# EAGLE board DAQShield (EAGLE 9.6.0)
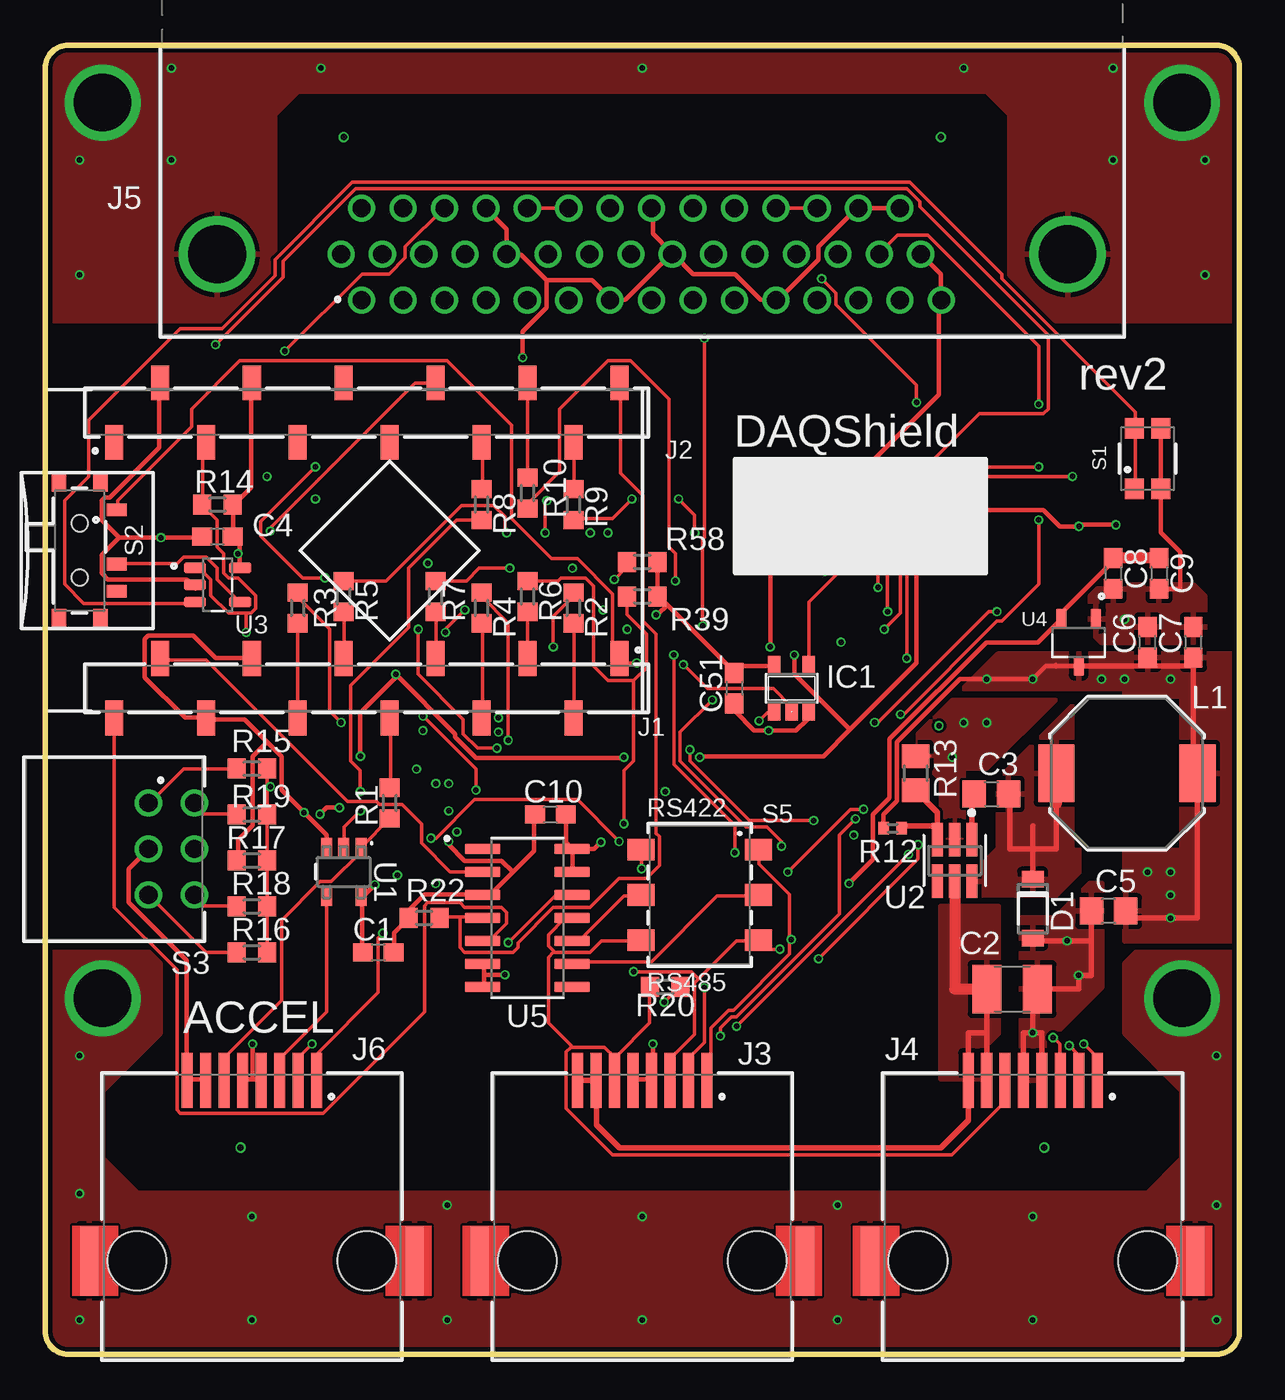
[diagram p6: board, top side]
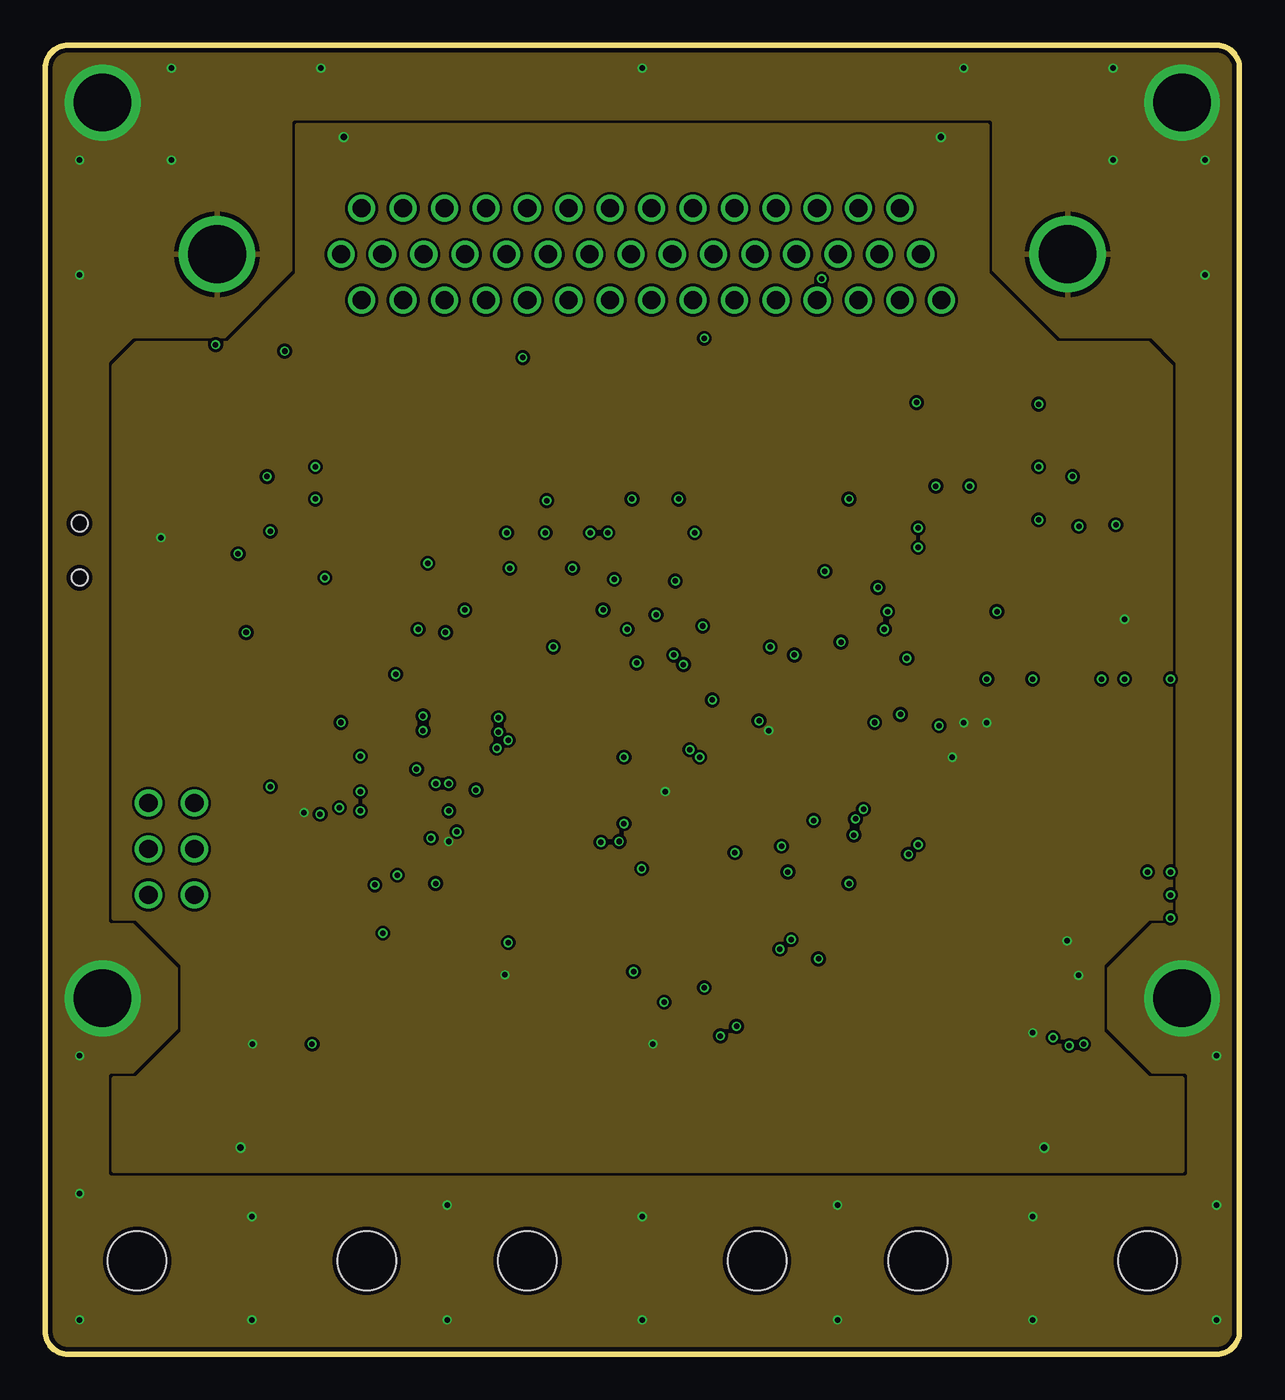
[diagram p7: board, inner layer Ground2]
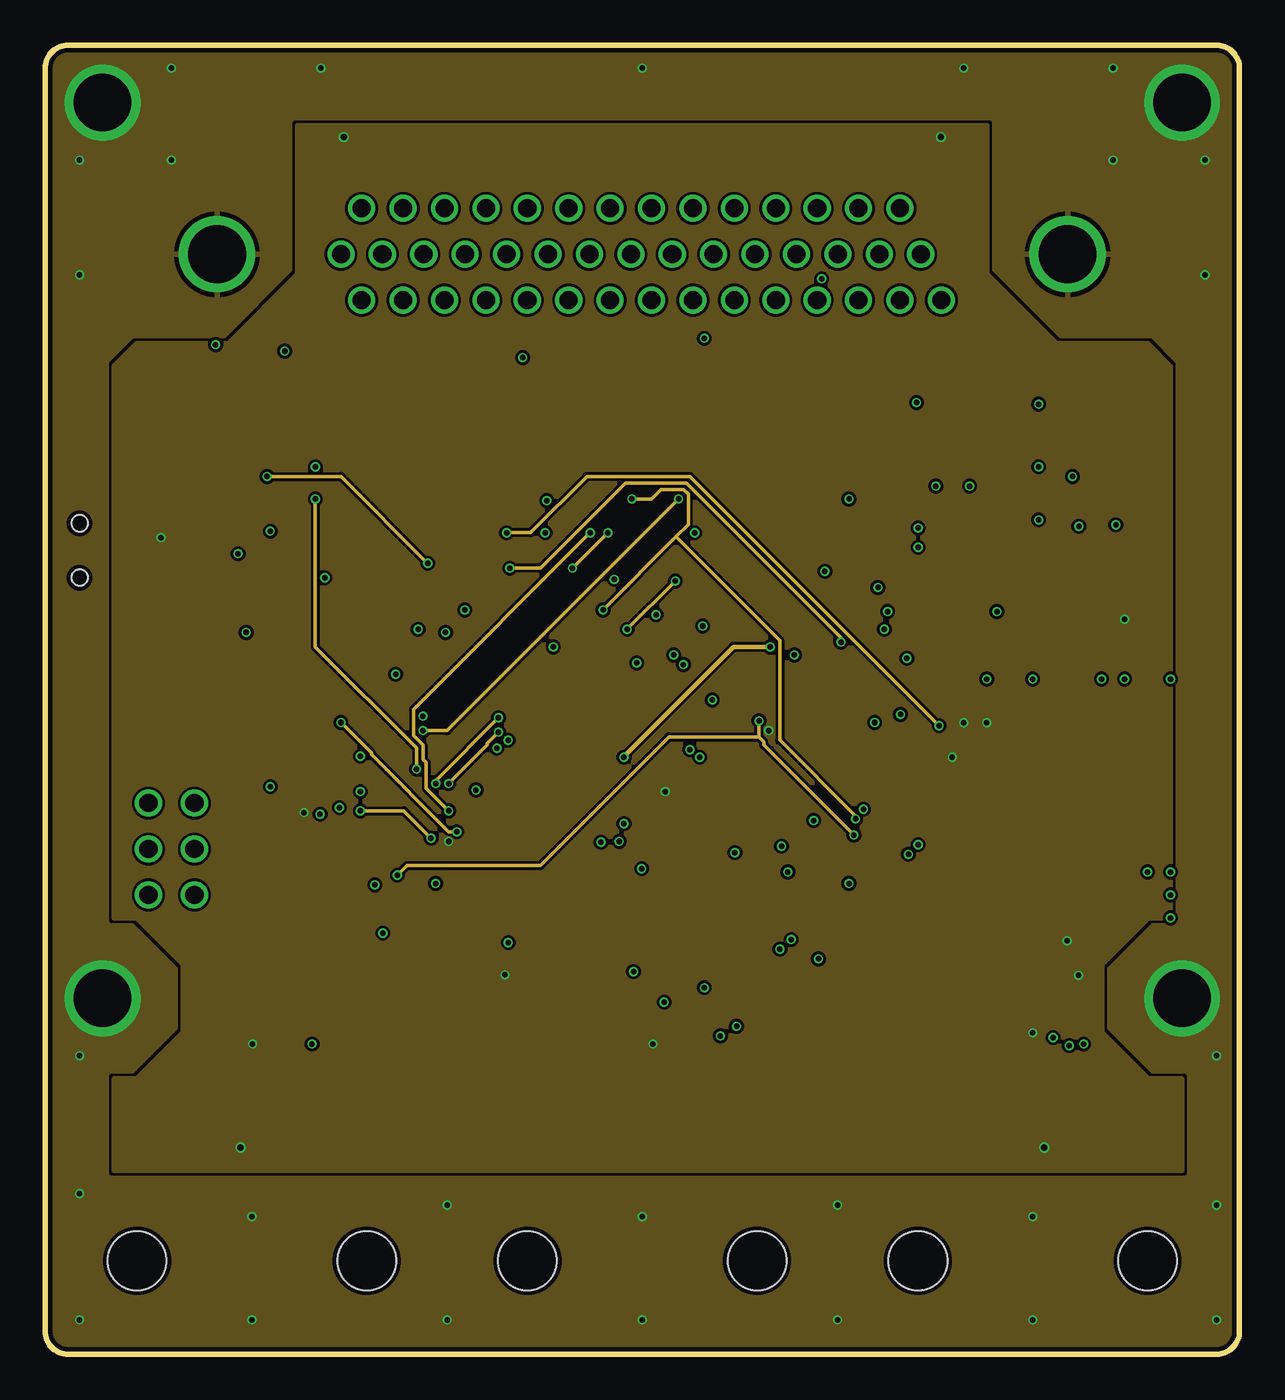
[diagram p8: board, inner layer Route3]
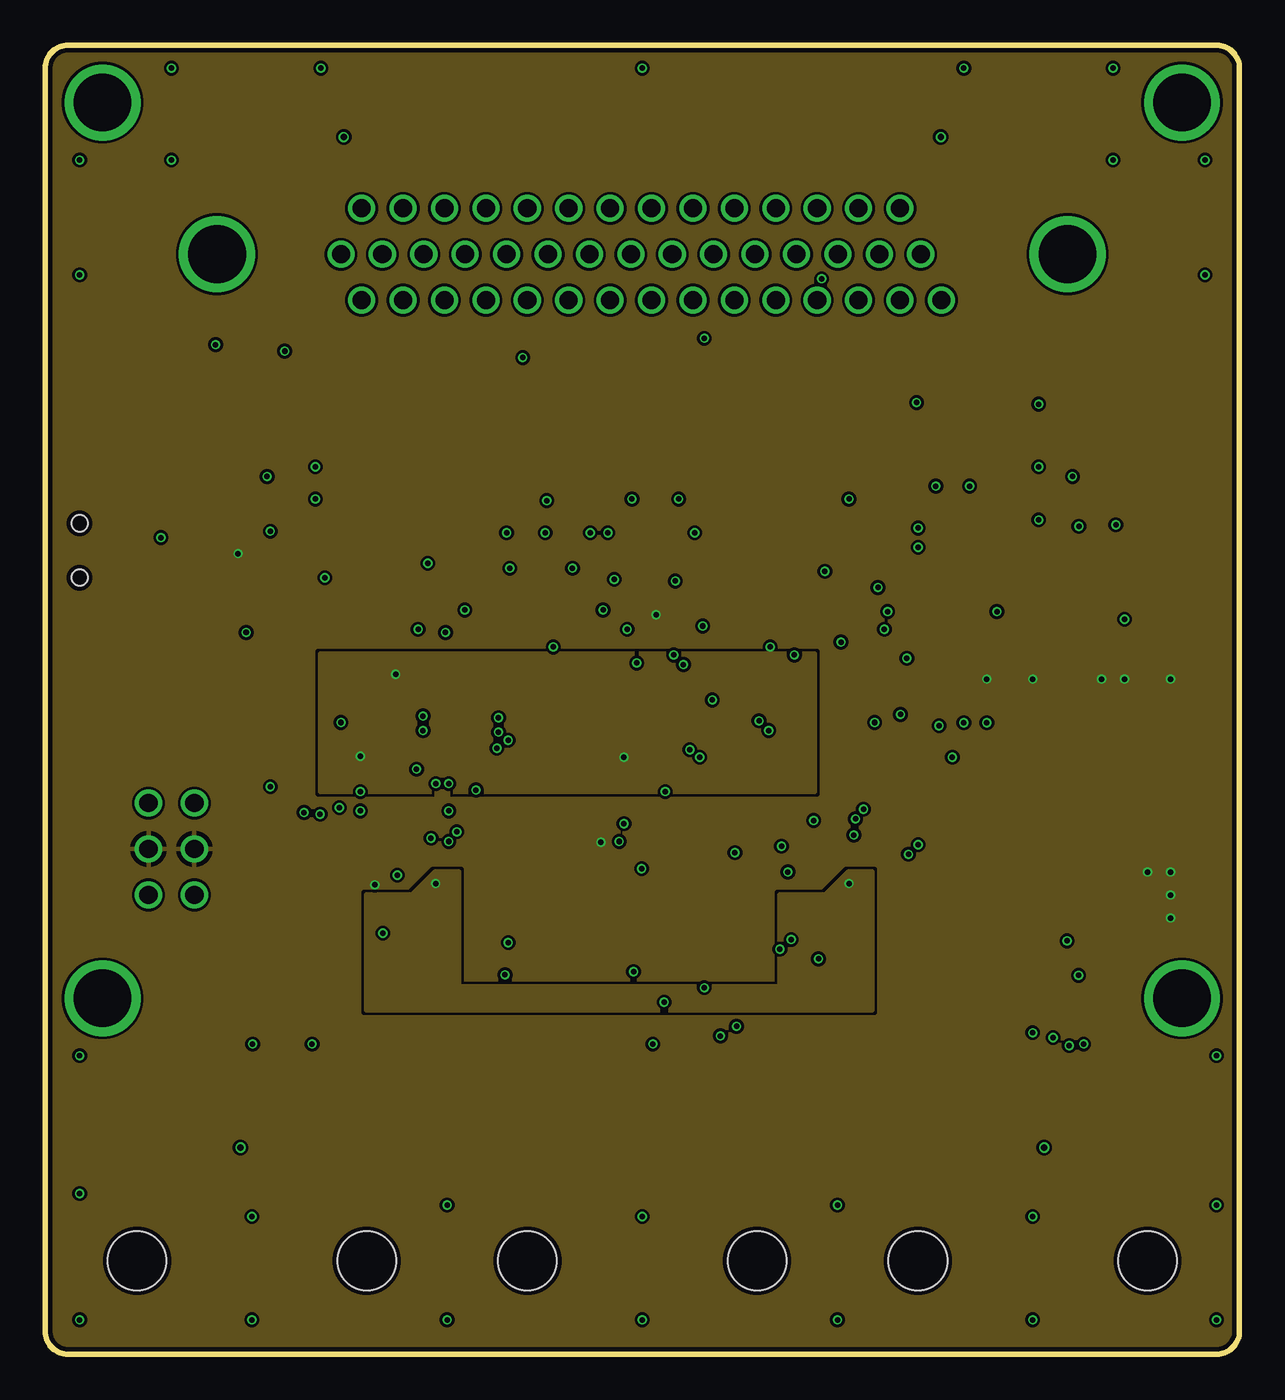
[diagram p9: board, inner layer Route14]
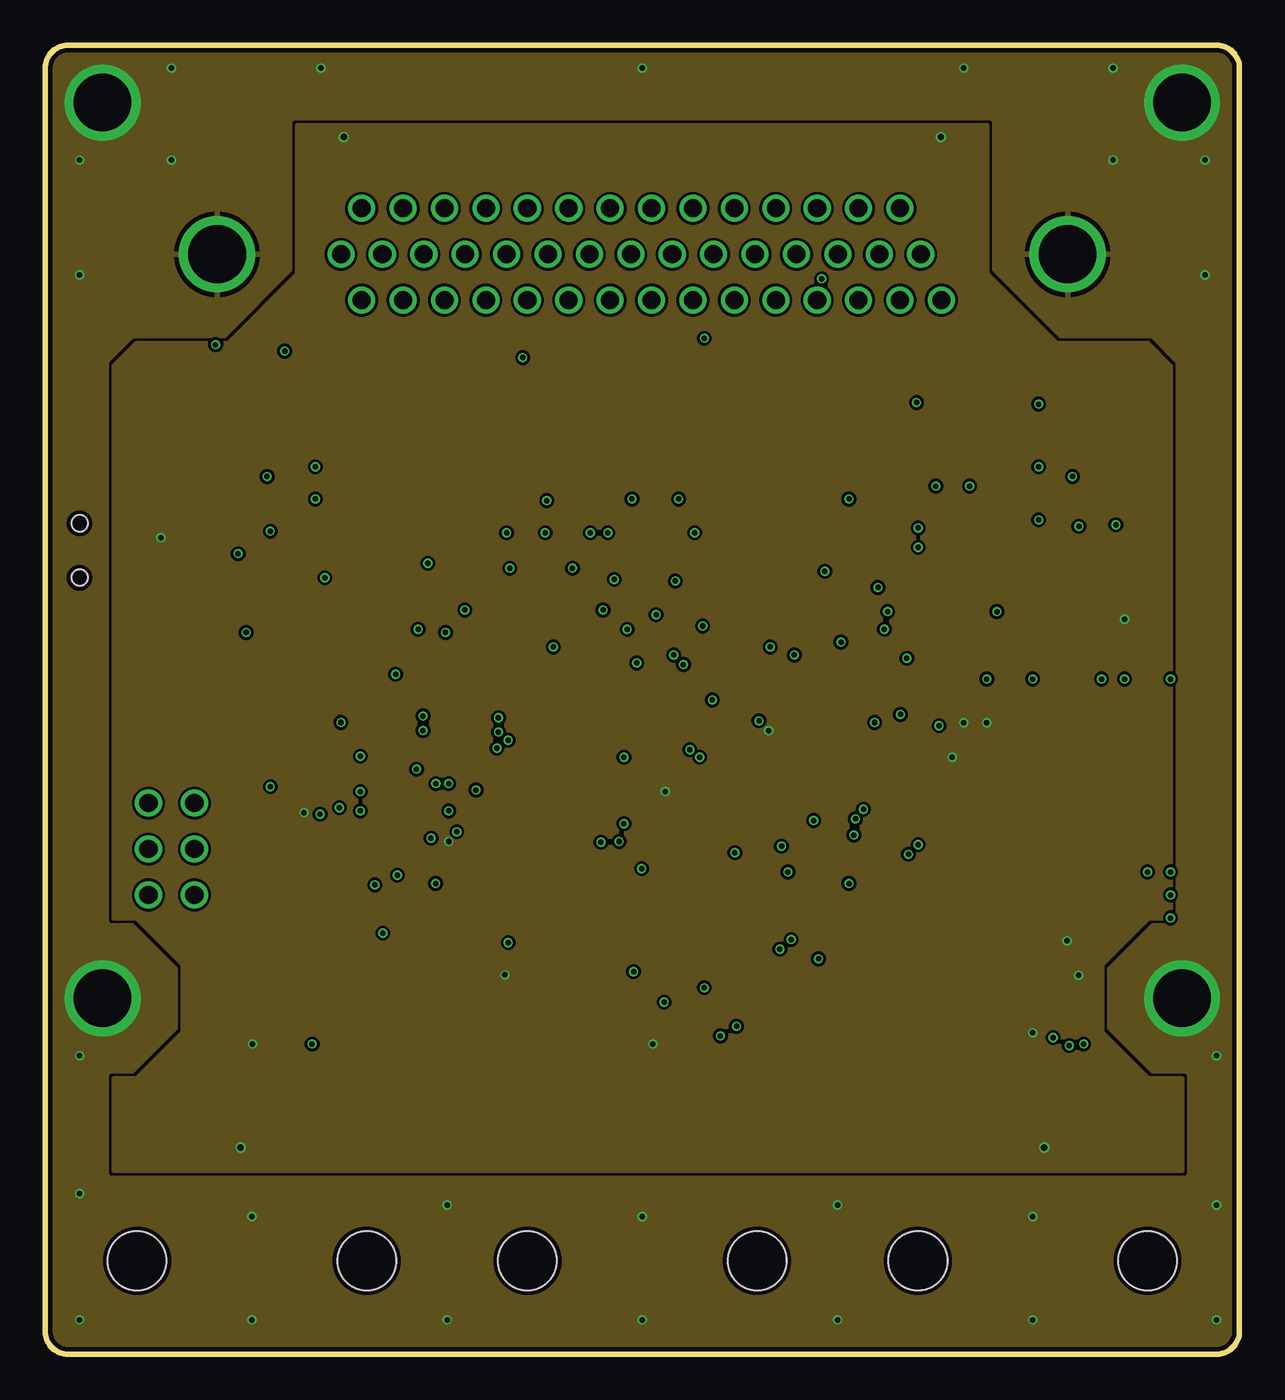
[diagram p10: board, inner layer Ground15]
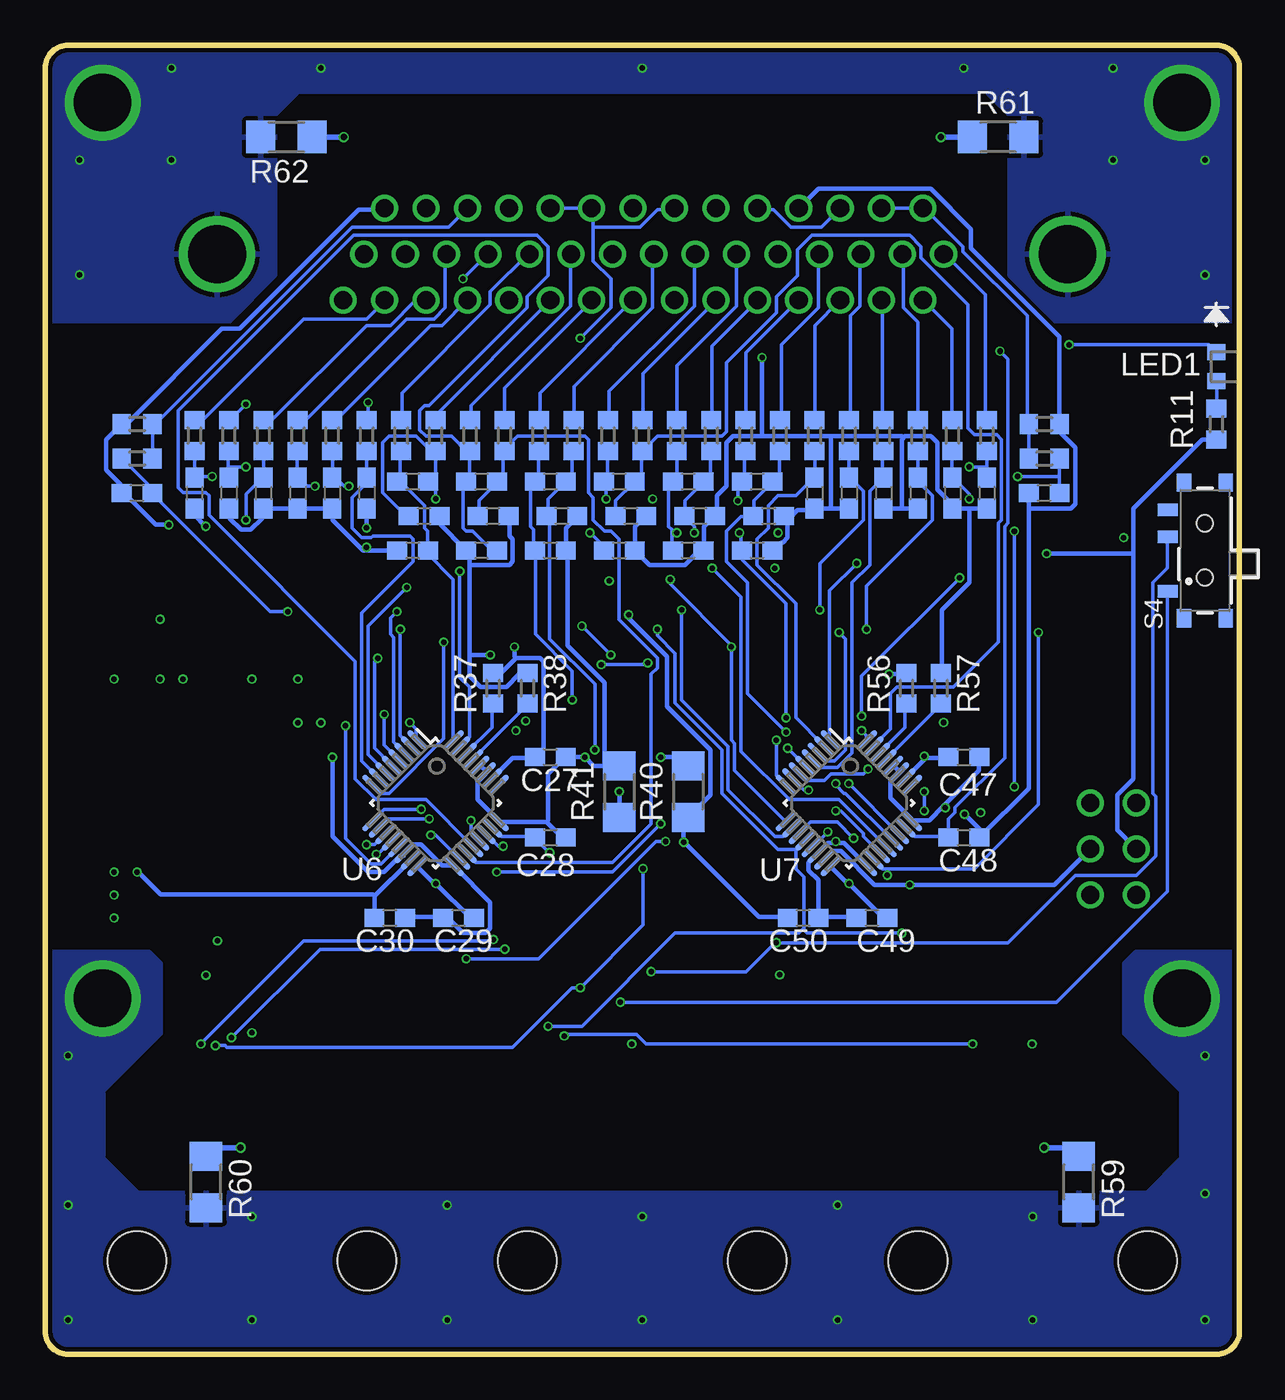
[diagram p11: board, bottom side, seen from below]

Size 66.04 x 72.39 mm. Coordinates in mm from the lower left corner, seen from the top.
Outline: 1.27,72.39 64.77,72.39 arc-90 66.04,71.12 66.04,1.27 arc-90 64.77,0 1.27,0 arc-90 0,1.27 0,71.12 arc-90 1.27,72.39
Copper layers (1+2*3+14*15+16): Top 0.0178mm / dielectric 17mil / Ground2 0.0356mm / dielectric 17mil / Route3 0.035mm / dielectric 17mil / Route14 0.035mm / dielectric 17mil / Ground15 0.0356mm / dielectric 17mil / Bottom 0.0178mm
Design rules "default *": minimum track width 1mil, minimum drill 10mil, track to track 6mil, track to pad 6mil, pad to pad 6mil, via to via 6mil, smd to smd 0mil, copper to edge 10mil, drill to drill 10mil, minimum pad ring 4mil, minimum via ring 4mil, stop-mask expansion 2mil, vias tented up to drill 25mil, thermal gap 10mil
Net classes: 0 Default: width 0.203 mm, drill 0.305 mm, clearance 0.152 mm; 1 Ground: width 0.254 mm, drill 0.305 mm, clearance 0.152 mm to class 0, clearance 0.152 mm; 2 Power: width 0.254 mm, drill 0.305 mm, clearance 0.152 mm to class 0, clearance 0.152 mm to class 1, clearance 0.152 mm; 3 diff pairs: width 0.203 mm, drill 0.305 mm, clearance 0.152 mm to class 0, clearance 0.152 mm to class 1, clearance 0.152 mm to class 2, clearance 0.152 mm

## Footprints (pad centres in the part's own frame; a part is rotated, then mirrored left to right if it is on the bottom)
C0603 = smd 1.1 x 1: 1 -0.85,0; 2 0.85,0
C1210 = smd 1.6 x 2.7: 1 -1.4,0; 2 1.4,0
C0805 = smd 1.3 x 1.5: 1 -0.95,0; 2 0.95,0
SOD123FL = smd 0.91 x 1.22: A 1.625,0; C -1.625,0
SOT23-5 = smd 0.69 x 0.99: 1 -0.95,-1.29; 2 0,-1.29; 3 0.95,-1.29; 4 0.95,1.3; 5 -0.95,1.3
61001213321 = smd 1 x 1.91: 1 13.97,1.645; 2 11.43,-1.645; 3 8.89,1.645; 4 6.35,-1.645; 5 3.81,1.645; 6 1.27,-1.645; 7 -1.27,1.645; 8 -3.81,-1.645; 9 -6.35,1.645; 10 -8.89,-1.645; 11 -11.43,1.645; 12 -13.97,-1.645
634008149821 = smd 0.61 x 3.05: 1 3.57,7.53; 2 2.55,7.53; 3 1.53,7.53; 4 0.51,7.53; 5 -0.51,7.53; 6 -1.53,7.53; 7 -2.55,7.53; 8 -3.57,7.53 | smd 1 x 3.89: S1 -9,-2.45; S2 9,-2.45 | hole 3.25: -6.35,-2.45; 6.35,-2.45
618044330923 = drill 1: 1 15.52,9.02; 2 13.23,9.02; 3 10.94,9.02; 4 8.65,9.02; 5 6.36,9.02; 6 4.07,9.02; 7 1.78,9.02; 8 -0.51,9.02; 9 -2.8,9.02; 10 -5.09,9.02; 11 -7.38,9.02; 12 -9.67,9.02; 13 -11.96,9.02; 14 -14.25,9.02; 15 -16.54,9.02; 16 16.665,6.48; 17 14.375,6.48; 18 12.085,6.48; 19 9.795,6.48; 20 7.505,6.48; 21 5.215,6.48; 22 2.925,6.48; 23 0.635,6.48; 24 -1.655,6.48; 25 -3.945,6.48; 26 -6.235,6.48; 27 -8.525,6.48; 28 -10.815,6.48; 29 -13.105,6.48; 30 -15.395,6.48; 31 15.52,3.94; 32 13.23,3.94; 33 10.94,3.94; 34 8.65,3.94; 35 6.36,3.94; 36 4.07,3.94; 37 1.78,3.94; 38 -0.51,3.94; 39 -2.8,3.94; 40 -5.09,3.94; 41 -7.38,3.94; 42 -9.67,3.94; 43 -11.96,3.94; 44 -14.25,3.94 | drill 3.2: S1 -23.52,6.48; S2 23.52,6.48
IND_BOURNS_SRU8043 = smd 2.007 x 3.2: 1 -3.899,0; 2 3.899,0
LED_APA1606_KNB = smd 0.889 x 0.991: 1 -0.8,0; 2 0.8,0
R0603 = smd 1 x 1.1: 1 -0.85,0; 2 0.85,0
R0402 = smd 0.6 x 0.7: 1 -0.5,0; 2 0.5,0
R0805 = smd 1.3 x 1.5: 1 -0.95,0; 2 0.95,0
R1206 = smd 1.6 x 1.803: 1 -1.422,0; 2 1.422,0
434153017835 = smd 1.15 x 1.05: 1 -1.675,0.725; 2 -1.675,-0.725; 3 1.675,0.725; 4 1.675,-0.725
450404015514 = smd 0.7 x 1.1: 1 2.25,-2.05; 2 -0.75,-2.05; 3 -2.25,-2.05 | smd 1 x 0.8: Z1 -3.75,1.15; Z2 3.75,1.15; Z3 3.75,-1.15; Z4 -3.75,-1.15 | hole 0.9: -1.5,0; 1.5,0
42842732091X_10POS = drill 1: 1 -2.54,1.9; 2 2.54,4.44; 4 2.54,1.9; 8 -2.54,4.44; C1 0,1.9; C2 0,4.44
452403012014 = smd 1.2 x 1.5: 1 -2.5,3.25; 2 0,3.25; 3 2.5,3.25; 4 -2.5,-3.25; 5 0,-3.25; 6 2.5,-3.25
DBV0005A_N = smd 1 x 0.6: 1 -1.375,0.95; 2 -1.375,0; 3 -1.375,-0.95; 4 1.375,-0.95; 5 1.375,0.95
DDC0006A-IPC_A = smd 1.854 x 0.612: 1 -1.15,0.95; 2 -1.15,0; 3 -1.15,-0.95; 4 1.15,-0.95; 5 1.15,0; 6 1.15,0.95
SOT95P280X145-5N = smd 1.21 x 0.59: 1 -1.255,0.95; 2 -1.255,0; 3 -1.255,-0.95; 4 1.255,-0.95; 5 1.255,0.95
SOT95P280X130-3N = smd 1.12 x 0.6: 1 -1.3,0.95; 2 -1.3,-0.95; 3 1.3,0
SOIC127P600X175-14N = smd 1.97 x 0.59: 1 -2.475,3.81; 2 -2.475,2.54; 3 -2.475,1.27; 4 -2.475,0; 5 -2.475,-1.27; 6 -2.475,-2.54; 7 -2.475,-3.81; 8 2.475,-3.81; 9 2.475,-2.54; 10 2.475,-1.27; 11 2.475,0; 12 2.475,1.27; 13 2.475,2.54; 14 2.475,3.81
PBS0032A_N = smd 1.4 x 0.3: 1 -3.2,1.75; 2 -3.2,1.25; 3 -3.2,0.75; 4 -3.2,0.25; 5 -3.2,-0.25; 6 -3.2,-0.75; 7 -3.2,-1.25; 8 -3.2,-1.75; 17 3.2,-1.75; 18 3.2,-1.25; 19 3.2,-0.75; 20 3.2,-0.25; 21 3.2,0.25; 22 3.2,0.75; 23 3.2,1.25; 24 3.2,1.75 | smd 0.3 x 1.4: 9 -1.75,-3.2; 10 -1.25,-3.2; 11 -0.75,-3.2; 12 -0.25,-3.2; 13 0.25,-3.2; 14 0.75,-3.2; 15 1.25,-3.2; 16 1.75,-3.2; 25 1.75,3.2; 26 1.25,3.2; 27 0.75,3.2; 28 0.25,3.2; 29 -0.25,3.2; 30 -0.75,3.2; 31 -1.25,3.2; 32 -1.75,3.2

## Placement (x,y rotation side)
A1  ARDUINO_PRO_MICRO  [ARDUINO_PRO_MICRO]  16.51,44.45 90 top
C1  1u  [C0603]  18.41,22.23 0 top
C2  10u  [C1210]  53.47,20.19 0 top
C3  0.1u  [C0805]  52.32,30.99 0 top
C4  0.1u  [C0603]  9.53,45.21 180 top
C5  10u  [C0805]  58.8,24.51 180 top
C6  1u  [C0603]  60.96,39.37 90 top
C7  0.1u  [C0603]  63.5,39.37 90 top
C8  1u  [C0603]  59.05,43.18 270 top
C9  0.1u  [C0603]  61.59,43.18 270 top
C10  0.1u  [C0603]  27.94,29.84 180 top
C11  0.1u  [C0603]  57.78,47.62 270 bottom
C12  0.1u  [C0603]  55.88,47.62 270 bottom
C13  0.1u  [C0603]  53.98,47.62 270 bottom
C14  0.1u  [C0603]  52.07,47.62 270 bottom
C15  0.1u  [C0603]  50.16,47.62 270 bottom
C16  0.1u  [C0603]  48.26,47.62 270 bottom
C17  0.1u  [C0603]  45.72,48.26 180 bottom
C18  0.1u  [C0603]  41.91,48.26 180 bottom
C19  0.1u  [C0603]  38.1,48.26 180 bottom
C20  0.1u  [C0603]  45.09,46.35 180 bottom
C21  0.1u  [C0603]  45.72,44.45 180 bottom
C22  0.1u  [C0603]  41.27,46.35 180 bottom
C23  0.1u  [C0603]  41.91,44.45 180 bottom
C24  0.1u  [C0603]  37.47,46.35 180 bottom
C25  0.1u  [C0603]  38.1,44.45 0 bottom
C26  0.1u  [C0603]  60.96,47.62 180 bottom
C27  0.33u  [C0603]  38.1,33.02 0 bottom
C28  10u  [C0603]  38.1,28.57 0 bottom
C29  0.1u  [C0603]  43.18,24.13 180 bottom
C30  0.1u  [C0603]  46.99,24.13 0 bottom
C31  0.1u  [C0603]  23.5,47.62 270 bottom
C32  0.1u  [C0603]  21.59,47.62 270 bottom
C33  0.1u  [C0603]  19.68,47.62 270 bottom
C34  0.1u  [C0603]  17.78,47.62 270 bottom
C35  0.1u  [C0603]  15.88,47.62 270 bottom
C36  0.1u  [C0603]  13.97,47.62 270 bottom
C37  0.1u  [C0603]  34.29,48.26 180 bottom
C38  0.1u  [C0603]  30.48,48.26 180 bottom
C39  0.1u  [C0603]  26.67,48.26 180 bottom
C40  0.1u  [C0603]  33.66,46.35 180 bottom
C41  0.1u  [C0603]  34.29,44.45 0 bottom
C42  0.1u  [C0603]  29.84,46.35 180 bottom
C43  0.1u  [C0603]  30.48,44.45 0 bottom
C44  0.1u  [C0603]  26.04,46.35 180 bottom
C45  0.1u  [C0603]  26.67,44.45 0 bottom
C46  0.1u  [C0603]  10.79,47.62 180 bottom
C47  0.33u  [C0603]  15.24,33.02 0 bottom
C48  10u  [C0603]  15.24,28.57 0 bottom
C49  0.1u  [C0603]  20.32,24.13 180 bottom
C50  0.1u  [C0603]  24.13,24.13 0 bottom
C51  0.1u  [C0603]  38.1,36.83 270 top
D1  PMEG6010CEH,115  [SOD123FL]  54.61,24.64 270 top
IC1  74AHC1G08DBV  [SOT23-5]  41.27,36.83 0 top
J1  [61001213321]  17.78,36.83 0 top
J2  [61001213321]  17.78,52.07 180 top
J3  634008149821  [634008149821]  33.02,7.62 0 top
J4  634008149821  [634008149821]  54.61,7.62 0 top
J5  [618044330923]  33.02,67.31 180 top
J6  634008149821  [634008149821]  11.43,7.62 0 top
L1  33u  [IND_BOURNS_SRU8043]  59.82,32.13 180 top
LED1  APA1606QBC/D  [LED_APA1606_KNB]  1.27,54.61 270 bottom
R1  47  [R0603]  19.05,30.48 90 top
R2  47  [R0603]  29.21,41.27 270 top
R3  47  [R0603]  13.97,41.27 270 top
R4  47  [R0603]  24.13,41.27 270 top
R5  47  [R0603]  16.51,41.91 90 top
R6  47  [R0603]  26.67,41.91 90 top
R7  47  [R0603]  21.59,41.91 90 top
R8  47  [R0603]  24.13,46.99 90 top
R9  47  [R0603]  29.21,46.99 90 top
R10  47  [R0603]  26.67,47.62 270 top
R11  110  [R0603]  1.27,51.44 270 bottom
R12  57.6k  [R0402]  46.86,29.08 180 top
R13  10.4k  [R0805]  48.13,32.13 270 top
R14  10k  [R0603]  9.53,46.99 0 top
R15  10k  [R0603]  11.43,32.38 180 top
R16  39.2k  [R0603]  11.43,22.23 180 top
R17  10k  [R0603]  11.43,27.3 0 top
R18  20k  [R0603]  11.43,24.77 180 top
R19  82.5k  [R0603]  11.43,29.84 180 top
R20  120  [R0603]  34.29,20.32 0 top
R22  10k  [R0603]  20.95,24.13 0 top
R23  150  [R0603]  44.45,50.8 270 bottom
R24  150  [R0603]  46.35,50.8 270 bottom
R25  150  [R0603]  57.78,50.8 270 bottom
R26  150  [R0603]  55.88,50.8 270 bottom
R27  150  [R0603]  53.98,50.8 270 bottom
R28  150  [R0603]  52.07,50.8 270 bottom
R29  150  [R0603]  50.16,50.8 270 bottom
R30  150  [R0603]  48.26,50.8 270 bottom
R31  150  [R0603]  40.64,50.8 270 bottom
R32  150  [R0603]  42.55,50.8 270 bottom
R33  150  [R0603]  36.83,50.8 270 bottom
R34  150  [R0603]  38.73,50.8 270 bottom
R35  1k  [R0603]  60.96,51.44 0 bottom
R36  150  [R0603]  60.96,49.53 180 bottom
R37  0  [R0603]  41.27,36.83 90 bottom
R38  0  [R0603]  39.37,36.83 270 bottom
R39  10k  [R0603]  33.02,41.91 0 top
R40  0  [R1206]  30.48,31.11 90 bottom
R41  0  [R1206]  34.29,31.11 90 bottom
R42  150  [R0603]  33.02,50.8 270 bottom
R43  150  [R0603]  34.92,50.8 270 bottom
R44  150  [R0603]  23.5,50.8 270 bottom
R45  150  [R0603]  21.59,50.8 270 bottom
R46  150  [R0603]  19.68,50.8 270 bottom
R47  150  [R0603]  17.78,50.8 270 bottom
R48  150  [R0603]  15.88,50.8 270 bottom
R49  150  [R0603]  13.97,50.8 270 bottom
R50  150  [R0603]  29.21,50.8 270 bottom
R51  150  [R0603]  31.11,50.8 270 bottom
R52  150  [R0603]  25.4,50.8 270 bottom
R53  150  [R0603]  27.3,50.8 270 bottom
R54  1k  [R0603]  10.79,51.44 180 bottom
R55  150  [R0603]  10.79,49.53 0 bottom
R56  0  [R0603]  18.41,36.83 90 bottom
R57  0  [R0603]  16.51,36.83 270 bottom
R58  10k  [R0603]  33.02,43.81 0 top
R59  0  [R1206]  8.89,9.53 270 bottom
R60  0  [R1206]  57.15,9.53 270 bottom
R61  0  [R1206]  13.34,67.31 0 bottom
R62  0  [R1206]  52.7,67.31 180 bottom
S1  434153017835  [434153017835]  60.96,49.53 90 top
S2  [450404015514]  1.91,44.45 90 top
S3  [42842732091X_10POS]  3.81,27.94 270 top
S4  [450404015514]  1.91,44.45 270 bottom
S5  [452403012014]  36.2,25.4 270 top
U1  Value  [DBV0005A_N]  16.51,26.67 270 top
U2  LV2862XLVDDCR  [DDC0006A-IPC_A]  50.29,27.3 270 top
U3  TPS3828-50DBVT  [SOT95P280X145-5N]  9.53,42.55 0 top
U4  XC6206P302MR  [SOT95P280X130-3N]  57.15,39.37 270 top
U5  MAX3491ECSD+  [SOIC127P600X175-14N]  26.67,24.13 0 top
U6  ADS114S08BS  [PBS0032A_N]  44.45,30.48 315 bottom
U7  ADS114S08BS  [PBS0032A_N]  21.59,30.48 315 bottom

## Tracks (layer width: path | path; a pad name or v marks a point on that pad's centre or on a via)
422DE
  Top 0.203: 22.94,24.18 24.18,24.18 U5.4 | 22.94,24.18 21.87,24.18 R22.2 | 22.94,24.18 22.94,22.49 23.2,22.23 25.87,22.23 26.14,22.49 26.14,22.76 28.09,24.71 30.14,24.71 31.74,26.31 33.25,26.31 33.96,27.03 33.96,28.63 33.78,28.8 33.78,39.83 33.07,40.54 33.07,47.47 31.83,48.72 31.83,53.7 J2.12
!ACC_CS
  Top 0.203: R1.1 19.02,29.6 17.51,28.09 U1.1 17.42,28 17.42,27.74 15.82,26.14 15.2,26.14 13.07,24 13.07,19.56 9.96,16.45 9.96,15.2 J6.6
!ADC1_CS  (via drill 0.3)
  Top 0.203: 32.54,37.25 31.11,37.25 30.32,38.05 30.32,42.49 29.87,42.94 28.54,42.94 28.36,42.76 R6.2 | 32.54,37.25 33.25,37.96 33.25,39.83 32.18,40.89 32.18,41.87 R39.1 | v45.25,30.14 44.54,30.14 v41.07,26.67 | v32,29.34 32,32.27 32.54,32.8 32.54,37.25
  Bottom 0.203: v45.25,30.14 47.3,30.14 47.92,29.52 U6.9 | v41.07,26.67 34.67,26.67 v32,29.34
!ADC1_DRDY  (via drill 0.3)
  Top 0.203: v25.51,45.43 25.43,45.52 25.43,46.32 24.8,46.94 23.02,46.94 18.85,42.76 16.54,42.76 R5.2
  Route3 0.203: v25.51,45.43 26.85,45.43 29.96,48.54 35.65,48.54 v49.43,34.76
  Bottom 0.203: v49.43,34.76 49.43,28.54 48.01,27.11 47.47,27.11 46.58,28 U6.13
!ADC2_CS  (via drill 0.3)
  Top 0.203: v28.09,39.12 28.09,40.8 29.16,41.87 29.16,42.05 R2.1 | v31.47,42.85 32.09,43.47 32.09,43.74 R58.1
  Bottom 0.203: U7.9 25.16,29.52 27.91,32.27 27.91,33.78 28.09,33.96 v28.09,39.12 28.09,39.2 31.47,42.58 v31.47,42.85
!ADC2_DRDY  (via drill 0.3)
  Top 0.203: v16.36,34.94 15.73,35.56 15.73,40.09 14.05,41.78 14.05,42.05 R3.1
  Route3 0.203: v16.36,34.94 18.05,33.25 18.05,33.16 22.31,28.89 v22.76,28.89
  Bottom 0.203: v22.76,28.89 23.65,28 U7.13
!RST  (via drill 0.3)
  Top 0.203: v39.47,35.03 39.92,35.47 40.27,35.47 IC1.1 | J2.3 8.89,50.41 8.71,50.23 8.71,47.03 R14.1 8.71,46.94 9.51,46.14 9.51,44.63 9.87,44.27 9.87,43.2 10.13,42.94 10.67,42.94 11.65,41.96 11.65,41.25 11.38,40.98 11.11,40.98 | 11.11,40.98 10.13,40.98 9.16,41.96 9.16,42.85 8.53,43.47 8.36,43.47 U3.1 | 11.11,40.98 v11.11,39.92
  Route3 0.203: 39.47,34.14 v39.47,35.03 | 39.47,34.14 39.74,33.87 39.74,33.69 v44.72,28.71 | 39.47,34.14 34.49,34.14 27.38,27.03 20,27.03 v19.47,26.49
  Bottom 0.203: v44.72,28.71 44.45,28.71 43.12,27.38 U6.18 | 19.47,26.85 14.67,26.85 11.11,30.4 v11.11,39.92 | 19.47,26.85 19.74,26.85 20.18,27.29 U7.18 | 19.47,26.85 v19.47,26.49
+3V3  (via drill 0.3)
  Top 0.254: v44.45,26.04 45.78,27.37 45.78,29.85 46.7,30.76 46.7,34.02 52.05,39.37 54.9,39.37 U4.2 56.27,40.72 56.27,41.07 58.94,43.74 C8.1
  Top 0.61: C9.1 C8.1
  Bottom 0.254: U7.16 21.67,26.04 v21.59,26.04 19.74,24.18 19.56,24.18 C49.1 | U6.16 44.53,26.04 v44.45,26.04 44.36,25.96 42.58,24.18 42.41,24.18 C29.1
  pour Route14: 22.86,20.32 22.86,26.67 21.59,26.67 20.32,25.4 17.78,25.4 17.78,19.05 45.72,19.05 45.72,26.67 44.45,26.67 43.18,25.4 40.64,25.4 40.64,20.32
+5V  (via drill 0.3)
  Top 0.254: R12.2 46.36,29.85 47.1,30.59 47.1,33.85 50.59,37.34 v52.07,37.34 v54.61,37.34 55.34,38.07 U4.3 | U5.14 30.35,27.94 v30.73,28.32 | U5.14 28.79,28.3 C10.1 | 10.76,44.27 10.76,44.9 10.49,45.16 C4.1 10.4,45.25 10.4,46.94 R14.2 10.49,47.03 11.38,47.92 11.38,53.7 J2.4 | 10.76,44.27 10.76,43.56 U3.5 | R58.2 33.87,43.74 33.87,41.96 R39.2 33.96,41.87 34.4,41.43 | IC1.5 40.27,38.05 38.49,38.05 38.14,37.69 C51.1 38.05,37.78 34.4,41.43 | J6.7 8.8,15.2 7.91,15.2 J6.8 7.82,15.29 7.82,21.78 4.62,24.98 4.62,26.85 5.69,27.91 S3.C1 | C1.1 17.51,22.23 17.51,25.25 U1.5 17.6,25.34 v18.22,25.96 | U5.13 29.16,27.83 U5.14 | 34.4,41.43 33.87,40.89 v33.78,40.89 | v10.67,44.27 10.76,44.27
  Top 0.305: C5.1 59.75,24.13 v62.23,24.13 63.72,24.13 63.72,31.75 | 63.72,31.75 L1.1 | 55.88,38.07 55.88,38.1 | C6.1 60.96,38.07 | 60.96,38.07 U4.3 | 60.96,38.07 63.5,38.07 C7.1 63.5,31.75 63.72,31.75
  Bottom 0.254: 47.83,25.34 47.83,24.18 C30.1 | 47.83,25.34 45.87,27.29 U6.15 | C50.1 24.98,24.18 26.58,24.18 30.67,28.27 v30.73,28.32 30.73,29.44 R40.1 30.4,29.78 29.25,30.94 29.25,33.43 31.65,35.83 31.65,38.58 33.78,40.72 v33.78,40.89 | 5.87,44.27 5.87,31.83 6.76,30.94 6.76,28.98 5.78,28 S3.C1 | 5.87,44.27 5.87,46.76 2.04,50.58 1.33,50.58 R11.2 | U7.15 22.94,27.38 22.49,27.83 22.05,27.83 20.18,25.96 v18.22,25.96 10.22,25.96 8.27,27.91 S3.C2 | 47.83,25.34 47.92,25.43 59.65,25.43 60.9,26.67 v60.96,26.67 | 5.87,44.27 v10.67,44.27
  other vias: 62.23,37.34 58.42,37.34 62.23,26.67 62.23,25.4 59.69,37.34
  pour Top: 59.69,22.86 66.04,22.86 66.04,38.73 52.7,38.73 50.8,36.83 59.69,36.83
  pour Route14 (rank 2): 0,72.39 66.04,72.39 66.04,0 0,0
A0  (via drill 0.3)
  Top 0.203: R16.1 12.27,22.23 12.27,24.71 R18.1 12.27,24.8 12.27,27.2 R17.2 12.27,27.38 12.27,29.78 R19.1 12.27,29.87 12.27,31.38 | 12.27,31.38 12.27,32.36 R15.1 | v12.45,45.52 12.45,45.7 20.45,53.7 21.51,53.7 J2.8 | v12.45,31.38 12.27,31.38
  Bottom 0.203: v12.45,31.38 v12.45,45.52
ACC_SCLK
  Top 0.203: U1.4 15.56,25.25 15.56,18.94 12.98,16.36 12.98,15.2 J6.3
ADC1_DIFF1_IN_N  (via drill 0.3)
  Top 0.203: v40.72,28.09 40.72,28.36 39.92,29.16 38.76,29.16 35.12,32.8 35.12,34.4 v36.89,36.18
  Bottom 0.203: R34.2 38.76,49.87 38.76,48.36 38.85,48.27 C19.2 39.03,48.18 39.2,48.01 39.2,45.78 39.03,45.61 39.03,44.45 C25.1 38.94,44.36 38.94,39.83 36.89,37.78 v36.89,36.18 | v40.72,28.09 40.98,28.09 41.6,28.71 U6.22
ADC1_DIFF1_IN_P  (via drill 0.3)
  Top 0.203: v42.49,29.52 38.94,29.52 35.65,32.8 v35.65,33.43
  Bottom 0.203: R33.2 36.89,49.87 36.89,48.63 37.25,48.27 C19.1 37.34,48.18 38.23,47.3 38.23,46.41 C24.2 38.14,46.41 38.14,39.56 35.65,37.07 v35.65,33.43 | v42.49,29.52 42.49,28.89 42.05,28.45 U6.21
ADC1_DIFF1_N
  Bottom 0.203: R34.1 38.67,51.65 38.67,53.16 33.6,58.23 J5.8
ADC1_DIFF1_P
  Bottom 0.203: R33.1 36.8,51.65 36.8,53.52 32.45,57.87 32.45,60.81 J5.23
ADC1_DIFF2_IN_N
  Bottom 0.203: C23.1 41.34,44.45 42.41,45.52 42.76,45.52 42.94,45.7 42.94,48.01 42.76,48.18 C18.2 42.76,48.36 42.58,48.54 42.58,49.87 R32.2 42.67,49.87 43.56,50.76 44.98,50.76 45.34,51.12 45.34,52.18 45.07,52.45 44.81,52.45 39.38,57.87 39.38,58.5 38.23,59.65 38.23,61.25 38.85,61.87 48.98,61.87 58.67,52.18 58.67,47.92 58.41,47.65 57.16,47.65 56.98,47.47 56.98,46.41 48.9,38.32 48.9,31.83 47.74,30.67 44.98,30.67 42.41,28.09 U6.20
ADC1_DIFF2_IN_P
  Bottom 0.203: C22.2 42.05,46.41 42.05,47.21 41.07,48.18 C18.1 41.07,48.36 40.72,48.72 40.72,49.87 R31.2 40.63,50.05 39.92,50.76 36.18,50.76 36.01,50.58 36.01,47.65 35.74,47.38 35.74,46.14 35.12,45.52 34.76,45.52 34.31,45.07 34.31,40.63 32.18,38.49 32.18,37.96 32.54,37.6 32.54,29.34 34.67,27.2 42.23,27.2 42.67,27.65 U6.19
ADC1_DIFF2_N
  Bottom 0.203: R32.1 42.49,51.65 42.49,52.45 36.98,57.96 36.98,60.81 J5.25
ADC1_DIFF2_P
  Bottom 0.203: R31.1 40.63,51.65 40.63,53.43 35.83,58.23 J5.9
ADC1_DIFF3_IN_N
  Bottom 0.203: R24.2 46.41,49.87 46.41,48.27 C17.2 46.49,48.18 46.32,48.18 45.07,46.94 45.07,45.7 44.9,45.52 44.9,44.45 C21.1 44.9,44.36 44.9,44.27 43.47,42.85 43.47,34.05 U6.32
ADC1_DIFF3_IN_P  (via drill 0.3)
  Top 0.203: v43.12,43.29 43.12,45.96 v44.45,47.3
  Bottom 0.203: C20.2 45.96,46.41 46.14,46.41 47.38,47.65 47.38,50.41 47.03,50.76 45.52,50.76 44.54,49.78 R23.2 44.45,48.63 44.81,48.27 C17.1 44.81,48.18 44.45,47.83 v44.45,47.3 | v43.12,43.29 43.12,37.43 42.58,36.89 42.58,34.14 43.03,33.69 U6.31
ADC1_DIFF3_N
  Bottom 0.203: R24.1 46.32,51.65 46.32,53.16 41.43,58.05 41.43,58.76 39.29,60.9 J5.26
ADC1_DIFF3_P
  Bottom 0.203: R23.1 44.45,51.92 38.14,58.23 J5.10
ADC1_REFOUT  (via drill 0.3)
  Top 0.203: v38.14,27.74 38.14,29.25 34.76,32.63 v34.76,38.67 | v36.36,40.27 36.36,45.07 36.45,45.16 v36.45,56.19
  Bottom 0.203: U6.23 41.25,29.07 40.8,28.63 39.03,28.63 C28.1 38.94,28.54 v38.14,27.74 | v36.36,40.27 v34.76,38.67 | v36.45,56.19 34.76,57.87 34.76,59.47 35.74,60.45 35.74,62.32 | 35.74,62.32 35.74,63.3 J5.39 35.92,63.39 38.05,63.39 J5.40 | 35.74,62.32 33.16,62.32 32.18,63.3 31.29,63.3 J5.37
ADC1_SE1  (via drill 0.3)
  Top 0.203: v48.18,52.63 48.18,53.61 43.74,58.05 43.74,58.67 v42.94,59.47
  Bottom 0.203: v48.18,52.63 48.18,51.65 R30.1 | v42.94,59.47 41.6,60.81 J5.27
ADC1_SE2
  Bottom 0.203: R29.1 50.14,51.65 49.96,51.65 44.72,56.9 44.09,56.9 42.76,58.23 J5.12
ADC1_SE3
  Bottom 0.203: R28.1 52.01,51.65 51.65,51.65 46.05,57.25 44.54,57.25 43.92,57.87 43.92,60.81 J5.28
ADC1_SE4
  Bottom 0.203: R27.1 53.96,51.65 53.52,51.65 48.27,56.9 46.94,56.9 45.61,58.23 44.98,58.23 J5.13
ADC1_SE5  (via drill 0.3)
  Top 0.203: v54.94,52.54 54.94,55.74 48.81,61.87 47.12,61.87 46.14,60.9 J5.29
  Bottom 0.203: v54.94,52.54 55.83,51.65 R26.1
ADC1_SE6
  Bottom 0.203: R25.1 57.34,51.65 51.74,57.25 48.27,57.25 47.3,58.23 J5.14
ADC1_SECOM
  Top 0.203: J5.41 40.45,63.39 42.67,63.39 J5.42
  Bottom 0.203: R36.1 60.1,49.61 60.1,51.38 R35.2 60.01,51.38 49.07,62.32 43.74,62.32 42.76,63.3 J5.42
ADC1_START/SYNC  (via drill 0.3)
  Top 0.203: v25.69,43.47 24,43.47 23.29,42.76 21.6,42.76 R7.2
  Route3 0.203: v25.69,43.47 27.38,43.47 32.09,48.18 35.47,48.18 44.01,39.65 v44.01,39.38
  Bottom 0.203: v44.01,39.38 44.01,34.05 47.03,31.03 47.47,31.03 47.92,31.47 U6.8
ADC2_DIFF1_IN_N  (via drill 0.3)
  Top 0.203: v27.65,45.43 27.65,47.12 v27.74,47.21
  Route3 0.203: v21.6,31.56 21.6,31.74 v25.07,35.2
  Bottom 0.203: v27.65,45.43 27.56,45.34 27.56,44.45 C45.1 27.47,44.36 27.47,43.92 25.07,41.52 v25.07,35.2 | v27.74,47.21 27.74,48.01 27.56,48.18 C39.2 27.47,48.27 27.38,48.36 27.38,49.87 R53.2 | v21.6,31.56 18.85,28.8 U7.22
ADC2_DIFF1_IN_P  (via drill 0.3)
  Route3 0.203: v22.31,31.56 24.45,33.69 24.45,33.78 v25.07,34.4
  Bottom 0.203: R52.2 25.43,49.87 25.43,48.63 25.78,48.27 C39.1 25.87,48.18 26.85,47.21 26.85,46.41 C44.2 26.94,46.32 27.56,46.32 28.36,45.52 28.36,43.83 27.2,42.67 27.2,36.54 v25.07,34.4 | v22.31,31.56 22.31,31.47 21.87,31.03 21.78,31.03 19.2,28.45 U7.21
ADC2_DIFF1_N
  Bottom 0.203: R53.1 27.29,55.38 24.45,58.23 J5.4
ADC2_DIFF1_P
  Bottom 0.203: R52.1 25.34,51.65 25.34,55.83 23.29,57.87 23.29,60.81 J5.19
ADC2_DIFF2_IN_N  (via drill 0.3)
  Route3 0.203: v31.11,45.43 v29.16,43.47
  Bottom 0.203: 31.38,45.43 31.38,45.61 31.56,45.78 31.56,48.01 31.38,48.18 C38.2 31.29,48.27 31.11,48.45 R51.2 | 31.38,45.43 31.38,44.45 C43.1 | v29.16,43.47 27.56,41.87 27.56,33.34 24.89,30.67 22.14,30.67 19.56,28.09 U7.20 | 31.38,45.43 v31.11,45.43
ADC2_DIFF2_IN_P  (via drill 0.3)
  Route3 0.203: v22.31,30.05 21.07,31.29 21.07,32.72 20.89,32.89 20.89,33.69 20.36,34.23 20.36,35.65 v30.14,45.43
  Bottom 0.203: R50.2 29.25,49.87 29.25,48.63 29.6,48.27 C38.1 29.69,48.18 30.67,47.21 30.67,46.41 C42.2 30.67,46.32 30.14,45.78 v30.14,45.43 | v22.31,30.05 22.05,30.05 20.8,28.8 20.8,28.63 19.91,27.74 U7.19
ADC2_DIFF2_N
  Bottom 0.203: R51.1 31.11,54.67 27.83,57.96 27.83,60.81 J5.21
ADC2_DIFF2_P
  Bottom 0.203: R50.1 29.16,51.65 29.16,55.74 26.67,58.23 J5.5
ADC2_DIFF3_IN_N  (via drill 0.3)
  Top 0.203: v35.92,45.43 35.92,46.41 v35.03,47.3
  Route3 0.203: v20.89,34.49 22.23,34.49 v35.03,47.3
  Bottom 0.203: R43.2 34.94,49.87 34.94,48.45 35.12,48.27 C37.2 35.03,48.27 v35.03,47.3 | v35.92,45.43 35.2,44.72 35.2,44.45 C41.1 | v20.89,34.49 20.62,34.23 20.62,34.05 U7.32
ADC2_DIFF3_IN_P
  Bottom 0.203: C40.2 34.49,46.41 34.49,47.21 33.52,48.18 C37.1 33.43,48.36 33.07,48.72 33.07,49.87 R42.2 32.98,49.96 32.18,50.76 28.63,50.76 28.36,51.03 28.36,54.85 25.6,57.61 25.6,58.5 24.45,59.65 24.45,61.07 23.65,61.87 18.22,61.87 17.6,61.25 17.6,60.63 15.02,58.05 15.02,51.21 14.67,50.85 13.42,50.85 13.16,50.58 13.16,46.14 13.34,45.96 13.34,39.38 15.82,36.89 18.94,36.89 19.29,36.54 19.29,34.58 20.18,33.69 U7.31
ADC2_DIFF3_N
  Bottom 0.203: R43.1 34.85,51.65 34.85,53.25 30.14,57.96 30.14,60.81 J5.22
ADC2_DIFF3_P
  Bottom 0.203: R42.1 32.98,51.65 32.98,54.23 28.98,58.23 J5.6
ADC2_REFOUT  (via drill 0.3)
  Top 0.203: J5.35 26.67,63.39 28.89,63.39 J5.36 | v13.25,55.47 17.51,59.74 19.02,59.74 19.91,60.63 19.91,61.25 22.05,63.39 J5.33
  Bottom 0.203: U7.23 18.4,29.07 17.96,28.63 16.09,28.63 C48.1 16.09,28.71 16.09,29.6 15.73,29.96 15.73,30.23 12.98,32.98 12.98,45.78 12.8,45.96 12.8,55.03 v13.25,55.47 | J5.35 26.58,63.3 25.78,63.3 24.8,62.32 23.11,62.32 22.14,63.3 J5.33
ADC2_SE1
  Bottom 0.203: R49.1 14.05,51.65 14.05,58.59 16.27,60.81 J5.16
ADC2_SE2
  Bottom 0.203: R48.1 15.91,51.65 15.91,56.72 17.42,58.23 J5.1
ADC2_SE3
  Bottom 0.203: R47.1 17.78,57.07 18.58,57.87 18.58,60.81 J5.17
ADC2_SE4
  Bottom 0.203: R46.1 19.74,51.65 19.74,58.23 J5.2
ADC2_SE5
  Bottom 0.203: R45.1 21.51,51.65 21.51,57.43 20.98,57.96 20.98,60.81 J5.18
ADC2_SE6
  Bottom 0.203: R44.1 23.47,51.65 23.47,56.9 22.14,58.23 J5.3
ADC2_SECOM
  Bottom 0.203: R55.1 11.65,49.61 11.65,51.38 R54.2 11.73,51.47 11.73,57.43 15.29,60.98 15.29,61.25 17.42,63.39 J5.31 17.6,63.39 19.74,63.39 J5.32
ADC2_START/SYNC  (via drill 0.3)
  Top 0.203: v25.6,33.96 25.6,40.45 24.18,41.87 24.18,42.05 R4.1
  Bottom 0.203: v25.6,33.96 25.6,32 25.16,31.56 U7.8
AGND  (via drill 0.3)
  Top 0.254: 44.49,34.54 43.03,33.07 36.27,33.07 v36.2,33.02 | 44.49,34.54 48.18,38.23 48.18,44.54 v48.27,44.63 v48.27,45.7 48.36,45.78 49.52,45.78 50.41,46.67 55.21,46.67 56.1,45.78 v57.16,45.78 57.25,45.87 v59.21,45.87 | v41.43,38.67 41.43,37.6 44.49,34.54 | v16.27,30.23 15.56,30.23 v15.2,29.87 | J5.34 24.45,63.3 25.51,62.23 25.51,60.9 J5.20 25.6,60.81 26.31,60.81 27.74,59.38 | J5.24 34.67,60.9 32.09,58.32 31.29,58.32 J5.7 31.2,58.41 30.23,59.38 27.74,59.38 | J5.38 33.6,63.3 33.6,61.96 34.58,60.98 J5.24 | J5.24 34.76,60.81 35.83,59.74 38.14,59.74 39.56,58.32 40.36,58.32 J5.11 40.45,58.41 40.63,58.41 42.76,60.54 42.76,61.25 44.9,63.39 J5.43 44.98,63.39 47.21,63.39 J5.44 | v26.4,55.12 26.4,56.54 27.74,57.87 27.74,59.38
  Bottom 0.254: 42.58,43.65 42.58,44.36 42.67,44.45 C23.2 42.85,44.54 44.18,45.87 44.18,46.32 C20.1 | 42.58,43.65 42.58,38.67 | 42.58,38.67 42.58,37.52 41.96,36.89 40.54,36.89 39.83,37.6 39.38,37.6 R38.1 | 42.58,43.65 40.36,43.65 40.18,43.83 40.18,45.07 40.36,45.25 40.36,46.32 C22.1 | 48.27,44.45 48.45,44.45 50.14,46.14 50.14,46.76 C15.2 50.23,46.76 52.01,46.76 C14.2 52.18,46.76 53.96,46.76 C13.2 54.05,46.67 54.05,46.23 54.67,45.61 55.21,45.61 55.83,46.23 55.83,46.76 C12.2 | 48.27,44.45 C21.2 | v48.27,45.7 48.27,46.76 C16.2 | v48.27,44.63 48.27,44.45 | C11.2 57.78,46.41 v57.16,45.78 | U6.28 41.96,32.54 41.69,32.27 U6.27 41.69,32.09 42.14,31.65 42.14,30.67 40.98,29.52 U6.24 40.89,29.43 38.32,29.43 | 38.32,29.43 37.52,28.63 37.34,28.63 C28.2 | C24.1 36.63,46.32 37.25,45.7 C25.2 37.16,44.36 37.16,39.2 35.12,37.16 35.12,32.63 R41.2 35.71,32.54 v36.2,33.02 C27.2 37.34,32.98 38.23,32.09 38.23,29.52 38.32,29.43 | v41.43,38.67 42.58,38.67 | U7.28 19.11,32.54 18.85,32.27 U7.27 18.85,32.09 19.29,31.65 19.29,30.76 18.14,29.6 U7.24 18.05,29.52 17.16,29.52 16.36,30.32 | 16.36,30.32 14.4,32.27 14.4,32.98 C47.2 | 11.65,46.76 11.65,47.56 C46.2 | 11.65,46.76 11.65,31.29 14.31,28.63 C48.2 14.22,28.89 v15.2,29.87 | 11.65,46.76 9.34,46.76 9.07,47.03 9.07,50.14 9.87,50.94 9.87,51.38 R54.1 9.96,51.56 9.96,56.27 14.85,61.16 14.85,62.23 17.07,64.45 23.29,64.45 24.36,63.39 J5.34 | v16.27,30.23 16.36,30.32 | 22.58,46.76 23.47,46.76 C31.2 23.56,46.67 24.45,46.67 24.89,46.23 C44.1 25.16,46.32 24.98,46.14 24.98,45.16 25.25,44.9 25.34,44.9 25.78,44.45 C45.2 | 22.58,46.76 21.6,46.76 C32.2
  Bottom 0.254: C40.1 32.89,46.32 33.43,45.78 33.43,44.45 C41.2 33.34,44.36 32.63,43.65 30.67,43.65 29.96,44.36 29.69,44.36 C43.2 29.6,44.45 29.6,45.78 29.07,46.32 C42.1 28.89,46.41 28.89,47.47 28.36,48.01 28.36,50.41 28,50.76 26.4,50.76 | 18.67,46.76 19.65,46.76 C33.2 | 18.67,46.76 C34.2 | 14.94,46.76 15.82,46.76 C35.2 15.73,46.85 16.71,47.83 16.71,50.41 17.07,50.76 18.49,50.76 18.58,50.67 | 14.94,46.76 14.05,46.76 C36.2 | 14.94,46.76 14.94,42.67 16.45,41.16 16.45,37.69 R57.1 | 18.67,46.76 18.67,50.58 18.58,50.67 | 22.58,50.76 18.67,50.76 18.58,50.67 | 22.58,50.76 26.4,50.76 | 22.58,50.76 22.58,46.76 | J5.44 47.3,63.3 48.72,63.3 55.3,56.72 56.27,56.72 61.52,51.47 61.7,51.47 R35.1 61.87,51.38 62.67,50.58 62.67,48.9 61.87,48.09 61.87,47.65 C26.2 61.7,47.65 59.92,45.87 v59.21,45.87 | v26.4,55.12 26.4,50.76
AVDD  (via drill 0.3)
  Top 0.254: v32,33.02 32,32.98 23.82,32.98 22.67,34.14 22.67,34.31 v19.38,37.6 19.38,37.43 17.42,35.47 v17.42,33.07 | J5.30 48.45,60.81 49.52,59.74 49.52,58.32 J5.15 49.43,58.23 49.43,53.07 40.09,43.74 v40.09,39.12
  Route3 0.254: v40.09,39.12 38.05,39.12 32,33.07 v32,33.02
  Bottom 0.254: R40.2 30.96,33.02 v32,33.02 | 17.34,32.98 16.09,32.98 C47.1 | 17.34,32.98 18.4,31.91 U7.26 | v19.38,37.6 18.49,37.6 R56.2 | v17.42,33.07 17.34,32.98 | U6.26 41.25,31.91 40.18,32.98 39.03,32.98 C27.1 38.85,33.07 38.49,33.43 38.49,38.32 38.67,38.49 40.01,38.49 | 40.01,38.49 40.8,37.69 41.25,37.69 R37.2 | v40.09,39.12 40.09,38.58 40.01,38.49
  pour Route14: 15.24,38.73 42.55,38.73 42.55,31.11 15.24,31.11
GND  (via drill 0.3, 0.35)
  Top 0.254: 12.27,33.87 11.02,35.12 8.89,35.12 J1.10 8.8,35.2 7.73,35.2 5.51,37.43 5.51,39.56 5.69,39.74 8.18,39.74 9.42,38.49 11.38,38.49 J1.9 | 12.27,33.87 13.07,33.07 13.07,31.2 v14.31,29.96 15.56,28.71 15.56,28.09 U1.3 | 12.27,33.87 11.47,33.07 11.47,29.25 10.67,28.45 10.67,27.38 R17.1 | 4.09,45.16 v6.4,45.16 8.62,45.16 C4.2 | 4.09,45.16 3.11,44.18 3.11,43.2 3.47,42.85 7.82,42.85 8,42.67 U3.2 | 4.09,45.16 3.11,46.14 3.11,47.21 3.29,47.38 3.56,47.38 6.31,50.14 6.31,53.7 J2.2 | C1.2 19.29,22.23 19.29,23.29 20.09,24.09 R22.1 20.18,24.18 20.18,24.62 20.98,25.43 24.09,25.43 U5.3 24.27,25.43 24.62,25.43 25.87,26.67 | 25.87,26.67 27.03,27.83 27.03,29.78 C10.2 | J3.5 32.54,15.2 33.52,15.2 J3.4 33.6,15.29 v33.6,17.16 | 11.47,15.2 11.91,15.2 J6.4 | 11.47,15.2 10.94,15.2 J6.5 | IC1.3 42.14,35.47 42.14,35.12 41.52,34.49 v40.01,34.49 39.2,34.49 38.14,35.56 38.14,35.92 C51.2 | 24.27,20.98 24.27,21.51 U5.6 | 24.27,20.98 24.27,20.36 U5.7 | S1.4 61.7,51.12 61.7,47.92 S1.2 61.7,47.74 61.7,45.43 62.76,44.36 62.76,42.33 C9.2 | v25.43,20.98 24.27,20.98 | v11.47,17.16 11.47,15.2 | 25.87,26.67 25.25,27.29 23.2,27.29 22.31,28.18 v22.31,28.36
  Top 0.305: 48.83,33.08 R13.1 | J4.5 54.1,17.78 v54.61,17.78 | J4.4 55.12,17.78 v54.61,17.78 | v54.61,17.78 54.61,20.19 C2.2 57.15,20.19 v57.15,20.95 57.85,20.95 57.85,22.86 | C5.2 57.85,22.86 | D1.A 54.61,22.86 57.85,22.86
  Top 0.61: U3.2 8.38,42.55
  Bottom 0.254: v34.29,31.11 R41.1 | C30.2 46.14,24.18 44.09,24.18 C29.2 43.92,24.09 43.74,24.09 42.94,23.29 41.69,23.29 41.43,23.56 41.43,24.98 43.38,26.94 U6.17 43.47,27.03 44.09,27.03 45.25,28.18 45.7,28.18 46.14,27.74 U6.14 46.23,27.56 46.41,27.56 47.3,26.67 48.18,26.67 50.14,28.63 50.14,32.98 v50.16,33.02 | C49.2 21.25,24.18 23.2,24.18 C50.2 23.29,24.27 23.29,26.23 23.82,26.76 23.82,27.2 23.38,27.65 U7.14 23.29,27.74 22.76,28.27 22.31,28.27 | 22.31,28.27 21.87,28.27 20.62,27.03 U7.17 | v22.31,28.36 22.31,28.27
  Bottom 0.305: R61.1 v16.51,67.31 | R62.1 v49.53,67.31 | R59.1 9.37,11.43 v10.79,11.43 | R60.1 56.67,11.43 v55.24,11.43
  other vias: 56.52,22.86 59.69,40.64 52.07,34.92 50.8,34.92
  pour Top: 53.98,13.97 55.24,13.97 55.24,17.14 58.42,20.32 58.42,26.04 57.78,26.04 55.88,24.13 53.98,24.13
  pour Top: 48.26,33.02 48.26,34.29 50.16,36.2 55.88,36.2 52.07,32.38 50.8,32.38 50.8,28.57 49.53,28.57 49.53,31.75
  pour Top: 57.78,41.27 57.78,40.01 58.42,39.37 63.5,39.37 64.14,40.01 64.14,41.91 63.5,42.55 58.42,42.55 57.78,41.91
  pour Ground15: 13.97,67.94 52.07,67.94 52.07,59.69 55.88,55.88 60.96,55.88 62.23,54.61 62.23,24.13 60.96,24.13 58.42,21.59 58.42,17.78 60.96,15.24 62.87,15.24 62.87,10.16 3.81,10.16 3.81,15.24 5.08,15.24 7.62,17.78 7.62,21.59 5.08,24.13 3.81,24.13 3.81,54.61 5.08,55.88 10.16,55.88 13.97,59.69
  pour Ground2: 13.97,67.94 52.07,67.94 52.07,59.69 55.88,55.88 60.96,55.88 62.23,54.61 62.23,24.13 60.96,24.13 58.42,21.59 58.42,17.78 60.96,15.24 62.87,15.24 62.87,10.16 3.81,10.16 3.81,15.24 5.08,15.24 7.62,17.78 7.62,21.59 5.08,24.13 3.81,24.13 3.81,54.61 5.08,55.88 10.16,55.88 13.97,59.69
  pour Route3: 13.97,67.94 52.07,67.94 52.07,59.69 55.88,55.88 60.96,55.88 62.23,54.61 62.23,24.13 60.96,24.13 58.42,21.59 58.42,17.78 60.96,15.24 62.87,15.24 62.87,10.16 3.81,10.16 3.81,15.24 5.08,15.24 7.62,17.78 7.62,21.59 5.08,24.13 3.81,24.13 3.81,54.61 5.08,55.88 10.16,55.88 13.97,59.69
GNDS  (via drill 0.3, 3.17)
  other vias: 3.17,69.22 62.87,69.22 62.87,19.68 3.17,19.68 1.91,1.91 1.91,8.89 1.91,16.51 22.23,1.91 22.23,8.26 43.81,8.26 43.81,1.91 64.77,1.91 64.77,8.26 64.77,16.51 1.91,66.04 6.99,71.12 59.05,71.12 64.14,66.04 64.14,59.69 1.91,59.69 6.99,66.04 15.24,71.12 33.02,71.12 50.8,71.12 59.05,66.04 11.43,7.62 11.43,1.91 33.02,7.62 33.02,1.91 54.61,7.62 54.61,1.91
  pour Top: 6.35,21.59 6.35,17.78 3.17,14.61 3.17,10.79 5.08,8.89 60.96,8.89 62.87,10.79 62.87,14.61 59.69,17.78 59.69,21.59 60.33,22.23 66.04,22.23 66.04,0 0,0 0,22.23 5.71,22.23
  pour Top: 0,57.15 10.16,57.15 12.7,59.69 12.7,68.58 13.97,69.85 52.07,69.85 53.34,68.58 53.34,59.69 55.88,57.15 66.04,57.15 66.04,72.39 0,72.39
  pour Ground2 (rank 2): 0,72.39 66.04,72.39 66.04,0 0,0
  pour Ground15 (rank 2): 0,72.39 66.04,72.39 66.04,0 0,0
  pour Bottom: 0,57.15 10.16,57.15 12.7,59.69 12.7,68.58 13.97,69.85 52.07,69.85 53.34,68.58 53.34,59.69 55.88,57.15 66.04,57.15 66.04,72.39 0,72.39
  pour Bottom: 6.35,21.59 6.35,17.78 3.17,14.61 3.17,10.79 5.08,8.89 60.96,8.89 62.87,10.79 62.87,14.61 59.69,17.78 59.69,21.59 60.33,22.23 66.04,22.23 66.04,0 0,0 0,22.23 5.71,22.23
  pour Route3 (rank 2): 0,72.39 66.04,72.39 66.04,0 0,0
MISO  (via drill 0.3)
  Top 0.203: R10.2 26.67,47.03 28.45,48.81 28.45,52.27 31.11,54.94 32.36,54.94 34.49,52.81 34.49,44.63 34.85,44.27 v34.85,42.76 | v38.23,18.14 v47.74,27.65 | v18.67,23.29 18.4,23.02 18.4,20 15.02,16.62 15.02,15.2 J6.1
  Route3 0.203: v32.18,40.09 v34.85,42.76
  Bottom 0.203: v32.18,40.09 32.18,39.74 31.2,38.76 31.2,36.01 28.63,33.43 28.63,31.03 25.51,27.91 24.54,27.91 | 24.54,27.91 24.09,28.36 U7.12 | v47.74,27.65 47.65,27.65 46.94,28.36 U6.12 | v38.23,18.14 36.36,18.14 31.2,23.29 24.36,23.29 24.14,23.51 | 24.14,23.51 24.09,23.56 24.09,26.4 24.54,26.85 24.54,27.91 | v18.67,23.29 23.91,23.29 24.14,23.51
MOSI  (via drill 0.3)
  Top 0.203: v32.45,47.3 31.38,46.23 29.25,46.23 R9.1 | v14.76,17.16 14.05,16.45 14.05,15.2 J6.2 | v37.34,17.6 37.34,18.05 37.96,18.67 38.23,18.67 43.92,24.36 43.92,28.71 v44.81,29.6
  Route3 0.203: v32.45,47.3 33.52,47.3 34.05,47.83 35.29,47.83 35.56,47.56 35.56,45.87 34.89,45.21 | v30.85,41.16 34.89,45.21 | v44.81,29.6 44.81,29.78 40.63,33.96 40.63,39.47 34.89,45.21
  Bottom 0.203: v30.85,41.16 30.85,36.18 28.27,33.6 28.27,31.2 25.69,28.63 25.25,28.63 24.8,29.07 U7.10 | v44.81,29.6 47.12,29.6 47.56,29.16 U6.10 | v14.76,17.16 32.8,17.16 33.34,17.69 37.25,17.69 v37.34,17.6
N$1
  Top 0.305: C3.1 51.24,30.86 U2.1
N$2
  Top 0.305: D1.C 54.61,27.94 | 54.61,27.94 54.61,29.21 | C3.2 53.34,30.99 53.34,27.94 54.61,27.94 | L1.2 55.92,27.94 54.61,27.94
  Top 0.61: L1.2 55.92,30.48
  pour Top: 51.44,26.67 52.7,27.94 52.7,31.75 57.15,36.2 57.15,26.67 55.88,25.4 51.44,25.4
N$3
  Top 0.305: R13.2 49.34,29.97 49.34,29.21 | 49.34,29.21 U2.3 | R12.1 47.49,29.21 49.34,29.21
N$4
  Top 0.203: S1.1 60.27,47.92 60.27,51.12 S1.3 60.27,51.3 60.27,52.09 52.9,59.47 52.9,59.74 47.83,64.81 16.98,64.81 12.71,60.54 12.71,59.65 9.78,56.72 7.47,56.72 2.4,51.65 2.4,48.54 1.07,47.21 1.07,42.58 2.13,41.52 8.27,41.52 U3.3
N$5
  Top 0.203: S2.2 4,43.74 7.29,43.74 7.64,44.09 8.89,44.09 9.51,43.47 9.51,42.85 10.76,41.6 U3.4
N$6  (via drill 0.3)
  Top 0.203: v9.42,55.83 13.16,59.56 13.16,60.45 17.16,64.45 47.65,64.45 48.36,63.74 48.36,63.48 55.47,56.36 55.47,52.27 55.21,52.01 51.65,52.01 45.7,46.05 45.7,45.07 42.23,41.6 IC1.4
  Bottom 0.203: v9.42,55.83 1.69,55.83 LED1.1
N$7
  Bottom 0.203: LED1.2 1.25,53.78 1.25,52.36 R11.1
N$18  (via drill 0.3)
  Top 0.203: v34.23,19.47 35.12,20.36 R20.2
  Bottom 0.203: v34.23,19.47 10.13,19.47 4,25.6 4,42.14 S4.1
N$19
  Top 0.203: R8.2 24.18,47.92 24.18,50.41 J2.9
N$20
  Top 0.203: R9.2 29.25,47.92 29.25,50.41 J2.11
N$21
  Top 0.203: J2.10 R10.1
N$22
  Top 0.203: R3.2 13.96,40.36 13.96,35.2 J1.8
N$23
  Top 0.203: R5.1 16.54,40.98 16.54,38.49 J1.7
N$28
  Top 0.203: R4.2 24.18,40.36 24.18,35.2 J1.4
N$32
  Top 0.203: R2.2 29.25,40.36 29.25,35.2 J1.2
N$35
  Top 0.203: R7.1 21.6,40.98 21.6,38.49 J1.5
N$36
  Top 0.203: J1.3 R6.1
N$37
  Top 0.203: R15.2 10.58,32.36 7.64,32.36 5.78,30.49 S3.1
N$38
  Top 0.203: R16.2 8.89,22.23 5.78,25.34 S3.4
N$39
  Top 0.203: R19.2 10.58,29.87 8.8,29.87 8.27,30.4 S3.8
N$40
  Top 0.203: R18.2 10.58,24.8 8.8,24.8 8.27,25.34 S3.2
N$41
  Top 0.203: R1.2 19.11,31.38 19.11,35.12 J1.6
N$42
  Bottom 0.203: R37.1 41.34,35.92 41.34,34.67 42.67,33.34 U6.30
N$43
  Bottom 0.203: R38.2 39.38,35.92 42.32,32.98 U6.29
N$54
  Bottom 0.203: R30.2 48.27,49.87 48.27,48.54 C16.1 48.27,48.45 48.27,48.18 49.07,47.38 49.07,45.7 48.54,45.16 48.01,45.16 47.92,45.25 45.87,45.25 45.7,45.07 45.7,43.83 48.54,40.98 48.54,32.8 47.65,31.91 U6.7
N$55  (via drill 0.3)
  Top 0.203: v46.05,42.41 46.05,45.87 48.18,48.01 v49.25,48.01
  Bottom 0.203: R29.2 50.14,49.87 50.14,48.54 C15.1 50.05,48.54 49.52,48.01 v49.25,48.01 | v46.05,42.41 48.18,40.27 48.18,33.16 47.3,32.27 U6.6
N$56  (via drill 0.3)
  Top 0.203: v47.65,38.49 47.65,45.87 48.54,46.76 49.87,46.76 v51.12,48.01
  Bottom 0.203: R28.2 52.09,49.87 52.09,48.54 C14.1 52.01,48.45 51.56,48.01 v51.12,48.01 | v47.65,38.49 47.83,38.32 47.83,33.52 46.94,32.63 U6.5
N$57  (via drill 0.3)
  Top 0.203: v47.3,35.38 47.47,35.38 52.63,40.54 52.9,40.54 54.94,42.58 v54.94,46.14
  Bottom 0.203: R27.2 53.96,49.87 53.96,48.54 C13.1 54.05,48.45 54.94,47.56 v54.94,46.14 | v47.3,35.38 47.3,33.69 46.58,32.98 U6.4
N$58  (via drill 0.3)
  Top 0.203: v46.58,41.07 46.58,45.87 48.18,47.47 49.52,47.47 50.23,48.18 50.23,48.45 50.85,49.07 v54.94,49.07
  Bottom 0.203: 55.92,49.07 55.92,49.87 R26.2 | 55.92,49.07 55.92,48.54 C12.1 | v46.58,41.07 46.94,40.72 46.94,39.83 46.76,39.65 46.76,33.87 46.23,33.34 U6.3 | 55.92,49.07 v54.94,49.07
N$59  (via drill 0.3)
  Top 0.203: v46.41,40.09 47.3,40.98 47.3,46.05 48.36,47.12 49.7,47.12 50.58,48.01 50.58,48.27 50.85,48.54 v56.81,48.54
  Bottom 0.203: R25.2 C11.1 57.7,48.54 v56.81,48.54 | v46.41,40.09 46.41,34.23 45.87,33.69 U6.2
N$60  (via drill 0.3)
  Top 0.203: v45.87,34.94 46.05,34.94 52.18,41.07 v52.63,41.07
  Bottom 0.203: R36.2 61.78,49.52 60.19,47.92 60.19,47.65 C26.1 60.1,47.56 53.61,41.07 v52.63,41.07 | v45.87,34.94 45.52,34.58 45.52,34.05 U6.1
N$64  (via drill 0.3)
  Top 0.203: v23.82,31.2 23.82,32.36 v20.89,35.29 | v15.47,42.94 14.22,42.94 11.91,45.25 11.91,46.05 v14.94,49.07
  Bottom 0.203: 13.96,49.07 13.96,49.87 R49.2 | 13.96,49.07 13.96,48.54 C36.1 | v23.82,31.2 24.09,31.2 24.71,31.83 U7.7 | v20.89,35.29 20.89,37.52 v15.47,42.94 | 13.96,49.07 v14.94,49.07
N$65  (via drill 0.3)
  Route3 0.203: v20.54,32.36 20.54,33.52 14.94,39.12 v14.94,47.3
  Bottom 0.203: R48.2 15.91,49.87 15.91,48.54 C35.1 15.82,48.45 14.94,47.56 v14.94,47.3 | v20.54,32.36 20.8,32.09 22.58,32.09 22.94,31.74 23.91,31.74 24.36,32.18 U7.6
N$66  (via drill 0.3)
  Top 0.203: v24.98,33.52 23.91,33.52 23.11,34.31 23.11,35.12 20.62,37.6 v20.62,40.09
  Bottom 0.203: R47.2 C34.1 17.69,48.45 17.69,48.18 16.98,47.47 16.98,46.14 20.62,42.49 v20.62,40.09 | v24.98,33.52 24.09,32.63 U7.5
N$67
  Bottom 0.203: R46.2 19.74,49.87 19.74,48.54 C33.1 19.74,48.45 20.45,47.74 20.45,43.65 21.43,42.67 21.43,33.25 22.23,32.45 23.2,32.45 23.65,32.89 U7.4
N$68  (via drill 0.3)
  Top 0.203: v22.14,39.92 22.14,40.09 v23.2,41.16
  Bottom 0.203: R45.2 21.6,49.87 21.6,48.54 C32.1 21.51,48.45 20.8,47.74 20.8,46.14 23.2,43.74 v23.2,41.16 | v22.14,39.92 21.78,39.56 21.78,33.43 22.4,32.8 22.85,32.8 23.29,33.25 U7.3
N$69
  Bottom 0.203: R44.2 23.47,49.87 23.47,48.54 C31.1 23.56,48.45 24.54,47.47 25.51,47.47 26.05,46.94 26.05,45.7 26.67,45.07 26.67,43.65 24.54,41.52 24.54,35.2 23.02,33.69 U7.2
N$70  (via drill 0.3)
  Route3 0.203: v21.16,43.74 16.36,48.54 v12.27,48.54
  Bottom 0.203: 9.96,48.54 9.96,49.52 R55.2 | 9.96,48.54 9.96,47.65 C46.1 | v21.16,43.74 22.67,42.23 22.67,34.05 U7.1 | 9.96,48.54 v12.27,48.54
N$74
  Bottom 0.203: R57.2 16.54,35.92 19.47,32.98 U7.29
N$75
  Bottom 0.203: R56.1 18.49,35.92 18.49,34.67 19.82,33.34 U7.30
RS4XX_TX_N
  Top 0.203: S5.5 32.89,25.34 32,25.34 29.6,22.94 29.16,22.94 U5.10
RS4XX_TX_P
  Top 0.203: S5.2 39.38,25.34 37.16,25.34 33.52,21.69 29.25,21.69 29.16,21.6 U5.9
RX_N
  Top 0.203: 28.18,22.23 30.14,22.23 30.76,22.85 32.89,22.85 S5.6 | 28.18,22.23 27.83,22.58 27.83,23.2 28.71,24.09 29.07,24.09 U5.11 | R20.1 33.43,20.27 33.43,18.31 31.56,16.45 31.56,15.2 J3.6 31.47,16.45 30.94,16.98 29.07,16.98 | 29.07,16.98 28.8,16.71 28.8,13.6 31.38,11.02 50.14,11.02 53.07,13.96 53.07,15.11 J4.6 | 28.18,22.23 28.09,22.23 27.83,21.96 27.83,18.31 29.07,17.07 29.07,16.98
RX_P  (via drill 0.3)
  Top 0.203: 36.14,20.76 35.92,20.54 35.92,17.69 34.58,16.36 34.58,15.2 J3.3 | 36.14,20.76 38.23,22.85 39.38,22.85 S5.3 39.47,22.85 39.92,22.4 v40.63,22.4 | v55.74,17.51 56.1,17.16 56.1,15.2 J4.3 | v25.6,22.76 28.18,25.34 29.07,25.34 U5.12 | 36.14,20.76 35.74,21.16 v32.54,21.16
  Bottom 0.203: v55.74,17.51 50.85,22.4 v40.63,22.4 | S4.2 4,45.16 4,43.47 4.8,42.67 4.8,31.03 4.62,30.85 4.62,27.56 5.69,26.49 9.07,26.49 12.8,22.76 v25.6,22.76 25.69,22.76 27.29,21.16 v32.54,21.16
RXI
  Top 0.203: U5.2 22.4,26.67 20.8,28.27 20.8,29.34 19.74,30.4 18.49,30.4 18.31,30.58 16.71,30.58 8.89,38.41 6.4,38.41 J1.11
SCLK  (via drill 0.3)
  Top 0.203: v17.42,30.05 16.54,29.16 16.54,28.09 U1.2 | v17.42,31.11 17.42,32.27 16.89,32.8 16.89,36.98 20.09,40.18 20.09,43.47 22.76,46.14 24.09,46.14 R8.1 | v48.27,28.18 48.27,27.38 v42.76,21.87 | v31.74,28.36 29.43,30.67 23.74,30.67 21.6,28.54 v21.34,28.54
  Route3 0.203: v21.34,28.54 19.82,30.05 v17.42,30.05
  Bottom 0.203: v17.42,31.11 v17.42,30.05 | v21.34,28.54 22.23,29.43 23.74,29.43 24.36,28.8 U7.11 | v48.27,28.18 47.83,28.18 47.3,28.71 U6.11 | v42.76,21.87 38.76,21.87 32.27,28.36 v31.74,28.36
TX_N  (via drill 0.3)
  Top 0.203: v32.98,26.85 32.98,27.83 S5.4 | v36.45,20.27 36.45,17.25 35.65,16.45 35.65,15.2 J3.2 | v56.63,17.07 57.07,16.62 57.07,15.2 J4.2
  Bottom 0.203: v32.98,26.85 32.98,23.74 v36.45,20.27 36.89,20.27 40.18,16.98 56.01,16.98 56.1,17.07 v56.63,17.07
TX_P  (via drill 0.3)
  Top 0.203: 41.16,22.94 41.16,22.14 38.05,19.02 37.78,19.02 36.8,18.05 36.8,15.38 36.63,15.2 J3.1 | 41.16,22.94 41.16,25.43 39.47,27.11 39.47,27.83 S5.1 | v57.43,17.16 58.14,16.45 58.14,15.2 J4.1 | v41.25,22.94 41.16,22.94
  Bottom 0.203: v57.43,17.16 51.74,22.85 41.34,22.85 v41.25,22.94
TXO
  Top 0.203: J1.12 3.82,35.12 3.82,24.71 7.29,21.25 7.29,13.51 7.47,13.34 15.38,13.34 20.98,18.94 20.98,24.8 21.16,24.98 22.94,24.98 23.2,24.71 25.25,24.71 25.51,24.45 25.51,23.82 24.62,22.94 24.27,22.94 U5.5
VBUS
  Top 0.305: J4.7 52.07,17.78 | 52.07,17.78 52.07,19.05 | 52.07,17.78 51.04,17.78 J4.8 51.04,12.94 49.53,11.43 31.75,11.43 30.48,12.7 J3.7 J3.8
  Top 0.61: 51.56,20.32 51.56,20.19 C2.1 50.29,20.19 U2.5
  pour Top: 52.07,15.24 52.07,17.14 52.7,17.78 52.7,24.77 49.53,24.77 49.53,15.24
WDOG  (via drill 0.3)
  Top 0.203: v35.29,38.14 36.63,36.8 40.27,36.8 41.25,35.83 41.25,35.56 IC1.2 | v32.72,38.23 32,38.23 31.83,38.41 J1.1 31.65,38.49 31.38,38.76 31.38,42.05 29.43,44.01 28,44.01 25.78,46.23 25.78,51.38 22.23,54.94 10.76,54.94 8.09,52.27 8.09,51.3 4,47.21 4,46.76 S2.1
  Bottom 0.203: v35.29,38.14 32.8,38.14 v32.72,38.23

## Text on the board
tNames: DAQShield | rev2 | RS422 | RS485 | ACCEL